# EAGLE design RasPi-Hi_Power (EAGLE 8.4.0)
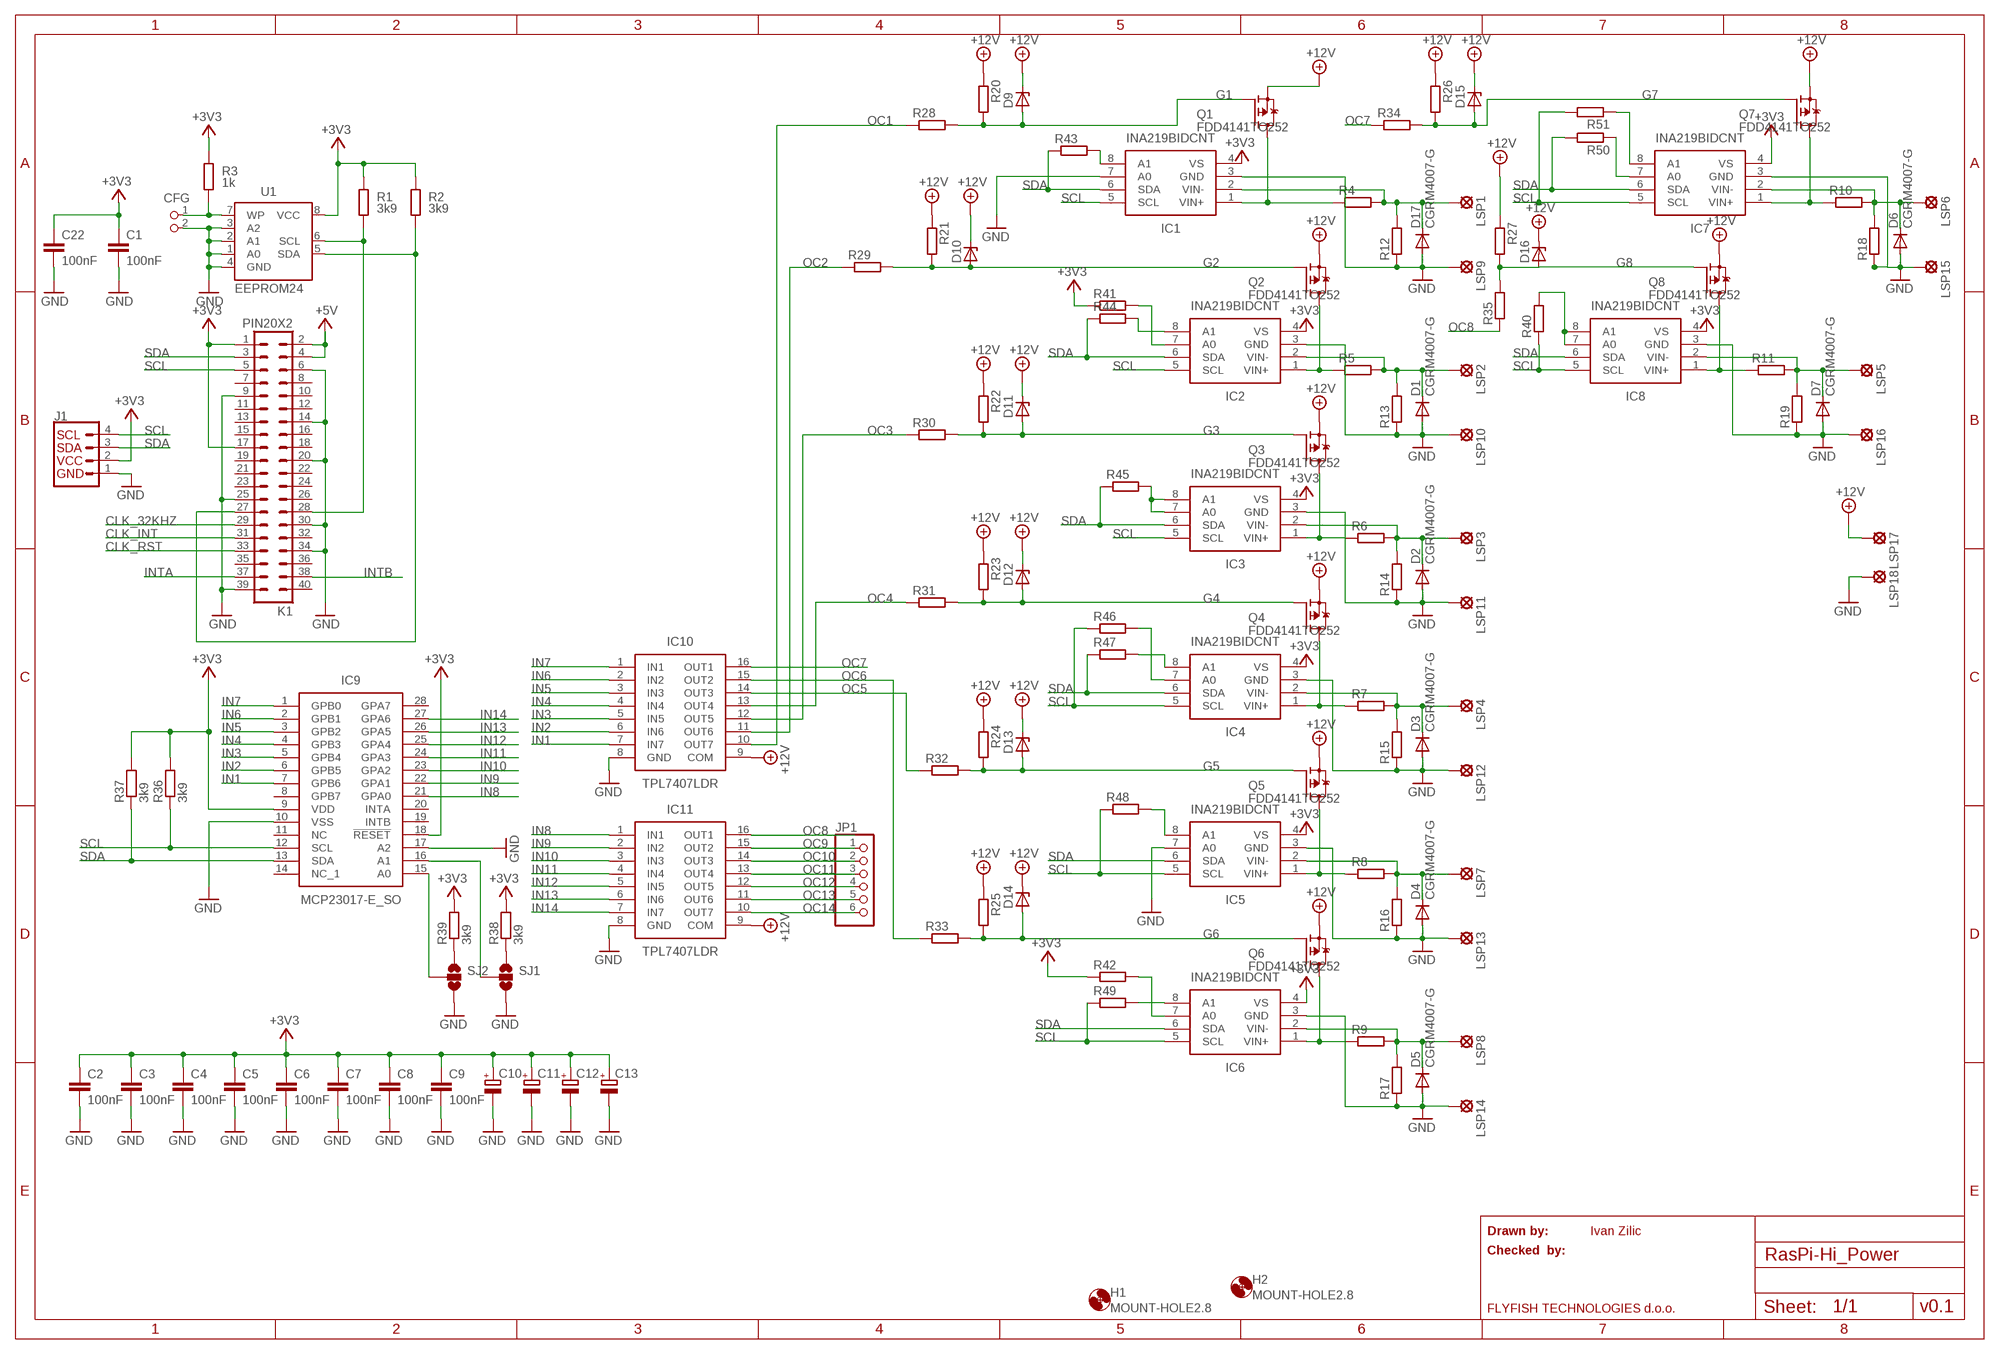
[diagram p0: schematic, sheet 1]

## Parts
C1  100nF  C-EUC0805K  [C0805K]
C2  100nF  C-EUC0805K  [C0805K]
C3  100nF  C-EUC0805K  [C0805K]
C4  100nF  C-EUC0805K  [C0805K]
C5  100nF  C-EUC0805K  [C0805K]
C6  100nF  C-EUC0805K  [C0805K]
C7  100nF  C-EUC0805K  [C0805K]
C8  100nF  C-EUC0805K  [C0805K]
C9  100nF  C-EUC0805K  [C0805K]
C10  CPOL-EUSMCD  [SMC_D]
C11  CPOL-EUSMCD  [SMC_D]
C12  CPOL-EUSMCD  [SMC_D]
C13  CPOL-EUSMCD  [SMC_D]
C22  100nF  C-EUC0805K  [C0805K]
CFG  PIN2_100  [PIN_W_2]
D1  CGRM4007-G  [SOD-123_MINI-SMA]
D2  CGRM4007-G  [SOD-123_MINI-SMA]
D3  CGRM4007-G  [SOD-123_MINI-SMA]
D4  CGRM4007-G  [SOD-123_MINI-SMA]
D5  CGRM4007-G  [SOD-123_MINI-SMA]
D6  CGRM4007-G  [SOD-123_MINI-SMA]
D7  CGRM4007-G  [SOD-123_MINI-SMA]
D9  ZENER-DIODESOT23  [SOT23]
D10  ZENER-DIODESOT23  [SOT23]
D11  ZENER-DIODESOT23  [SOT23]
D12  ZENER-DIODESOT23  [SOT23]
D13  ZENER-DIODESOT23  [SOT23]
D14  ZENER-DIODESOT23  [SOT23]
D15  ZENER-DIODESOT23  [SOT23]
D16  ZENER-DIODESOT23  [SOT23]
D17  CGRM4007-G  [SOD-123_MINI-SMA]
H1  MOUNT-HOLE2.8  [2,8]
H2  MOUNT-HOLE2.8  [2,8]
IC1  INA219BIDCNT  [SOT65P280X145-8N]
IC2  INA219BIDCNT  [SOT65P280X145-8N]
IC3  INA219BIDCNT  [SOT65P280X145-8N]
IC4  INA219BIDCNT  [SOT65P280X145-8N]
IC5  INA219BIDCNT  [SOT65P280X145-8N]
IC6  INA219BIDCNT  [SOT65P280X145-8N]
IC7  INA219BIDCNT  [SOT65P280X145-8N]
IC8  INA219BIDCNT  [SOT65P280X145-8N]
IC9  MCP23017-E_SO  [SOIC127P1030X265-28N]
IC10  TPL7407LDR  [SOIC127P600X175-16N]
IC11  TPL7407LDR  [SOIC127P600X175-16N]
J1  I2C_STANDARD  [1X04]
JP1  PINHD-1X6  [1X06]
K1  PIN20X2  [PIN_20X2]
LSP1  SE13  [SE13]
LSP2  SE13  [SE13]
LSP3  SE13  [SE13]
LSP4  SE13  [SE13]
LSP5  SE13  [SE13]
LSP6  SE13  [SE13]
LSP7  SE13  [SE13]
LSP8  SE13  [SE13]
LSP9  SE13  [SE13]
LSP10  SE13  [SE13]
LSP11  SE13  [SE13]
LSP12  SE13  [SE13]
LSP13  SE13  [SE13]
LSP14  SE13  [SE13]
LSP15  SE13  [SE13]
LSP16  SE13  [SE13]
LSP17  SE13  [SE13]
LSP18  SE13  [SE13]
Q1  FDD4141TO252  [TO252]
Q2  FDD4141TO252  [TO252]
Q3  FDD4141TO252  [TO252]
Q4  FDD4141TO252  [TO252]
Q5  FDD4141TO252  [TO252]
Q6  FDD4141TO252  [TO252]
Q7  FDD4141TO252  [TO252]
Q8  FDD4141TO252  [TO252]
R1  3k9  R-EU_M0805  [M0805]
R2  3k9  R-EU_M0805  [M0805]
R3  1k  R-EU_M0805  [M0805]
R4  R-EU_R1210  [R1210]
R5  R-EU_R1210  [R1210]
R6  R-EU_R1210  [R1210]
R7  R-EU_R1210  [R1210]
R8  R-EU_R1210  [R1210]
R9  R-EU_R1210  [R1210]
R10  R-EU_R1210  [R1210]
R11  R-EU_R1210  [R1210]
R12  R-EU_R0805  [R0805]
R13  R-EU_R0805  [R0805]
R14  R-EU_R0805  [R0805]
R15  R-EU_R0805  [R0805]
R16  R-EU_R0805  [R0805]
R17  R-EU_R0805  [R0805]
R18  R-EU_R0805  [R0805]
R19  R-EU_R0805  [R0805]
R20  R-EU_R0805  [R0805]
R21  R-EU_R0805  [R0805]
R22  R-EU_R0805  [R0805]
R23  R-EU_R0805  [R0805]
R24  R-EU_R0805  [R0805]
R25  R-EU_R0805  [R0805]
R26  R-EU_R0805  [R0805]
R27  R-EU_R0805  [R0805]
R28  R-EU_R0805  [R0805]
R29  R-EU_R0805  [R0805]
R30  R-EU_R0805  [R0805]
R31  R-EU_R0805  [R0805]
R32  R-EU_R0805  [R0805]
R33  R-EU_R0805  [R0805]
R34  R-EU_R0805  [R0805]
R35  R-EU_R0805  [R0805]
R36  3k9  R-EU_M0805  [M0805]
R37  3k9  R-EU_M0805  [M0805]
R38  3k9  R-EU_R0603  [R0603]
R39  3k9  R-EU_R0603  [R0603]
R40  R-EU_R0603  [R0603]
R41  R-EU_R0805  [R0805]
R42  R-EU_R0805  [R0805]
R43  R-EU_R0805  [R0805]
R44  R-EU_R0805  [R0805]
R45  R-EU_R0805  [R0805]
R46  R-EU_R0805  [R0805]
R47  R-EU_R0805  [R0805]
R48  R-EU_R0805  [R0805]
R49  R-EU_R0805  [R0805]
R50  R-EU_R0805  [R0805]
R51  R-EU_R0805  [R0805]
SJ1  SOLDERJUMPER_2WAYT  [SJ_2]
SJ2  SOLDERJUMPER_2WAYT  [SJ_2]
U1  EEPROM24  [SOIC8]

## Nets
+3V3: C1.1 C2.1 C3.1 C4.1 C5.1 C6.1 C7.1 C8.1 C9.1 C10.+ C11.+ C12.+ C13.+ C22.1 IC1.4(VS) IC2.4(VS) IC3.4(VS) IC4.4(VS) IC5.4(VS) IC6.4(VS) IC7.4(VS) IC8.4(VS) IC9.9(VDD) IC9.18(!RESET) J1.2 K1.1 K1.17 R1.2 R2.2 R3.2 R36.2 R37.2 R38.2 R39.2 R41.1 R42.1 U1.8(VCC)
+5V: K1.2 K1.4
+12V: D9.3(C) D10.3(C) D11.3(C) D12.3(C) D13.3(C) D14.3(C) D15.3(C) D16.3(C) IC10.9(COM) IC11.9(COM) LSP17.MP Q1.2(S) Q2.2(S) Q3.2(S) Q4.2(S) Q5.2(S) Q6.2(S) Q7.2(S) Q8.2(S) R20.1 R21.1 R22.1 R23.1 R24.1 R25.1 R26.1 R27.1
CLK_32KHZ: K1.29
CLK_INT: K1.31
CLK_RST: K1.33
G1: D9.1(A) Q1.1(G) R20.2 R28.2
G2: D10.1(A) Q2.1(G) R21.2 R29.2
G3: D11.1(A) Q3.1(G) R22.2 R30.2
G4: D12.1(A) Q4.1(G) R23.2 R31.2
G5: D13.1(A) Q5.1(G) R24.2 R32.2
G6: D14.1(A) Q6.1(G) R25.2 R33.2
G7: D15.1(A) Q7.1(G) R26.2 R34.2
G8: D16.1(A) Q8.1(G) R27.2 R35.2
GND: C1.2 C2.2 C3.2 C4.2 C5.2 C6.2 C7.2 C8.2 C9.2 C10.- C11.- C12.- C13.- C22.2 CFG.2 D1.A D2.A D3.A D4.A D5.A D6.A D7.A D17.A IC1.3(GND) IC1.7(A0) IC2.3(GND) IC3.3(GND) IC4.3(GND) IC5.3(GND) IC5.7(A0) IC6.3(GND) IC7.3(GND) IC8.3(GND) IC9.10(VSS) IC9.17(A2) IC10.8(GND) IC11.8(GND) J1.1 K1.6 K1.9 K1.14 K1.20 K1.25 K1.30 K1.34 K1.39 LSP9.MP LSP10.MP LSP11.MP LSP12.MP LSP13.MP LSP14.MP LSP15.MP LSP16.MP LSP18.MP R12.1 R13.1 R14.1 R15.1 R16.1 R17.1 R18.1 R19.1 SJ1.3 SJ2.3 U1.1(A0) U1.2(A1) U1.3(A2) U1.4(GND)
IN1: IC9.7(GPB6) IC10.7(IN7)
IN2: IC9.6(GPB5) IC10.6(IN6)
IN3: IC9.5(GPB4) IC10.5(IN5)
IN4: IC9.4(GPB3) IC10.4(IN4)
IN5: IC9.3(GPB2) IC10.3(IN3)
IN6: IC9.2(GPB1) IC10.2(IN2)
IN7: IC9.1(GPB0) IC10.1(IN1)
IN8: IC9.21(GPA0) IC11.1(IN1)
IN9: IC9.22(GPA1) IC11.2(IN2)
IN10: IC9.23(GPA2) IC11.3(IN3)
IN11: IC9.24(GPA3) IC11.4(IN4)
IN12: IC9.25(GPA4) IC11.5(IN5)
IN13: IC9.26(GPA5) IC11.6(IN6)
IN14: IC9.27(GPA6) IC11.7(IN7)
INTA: K1.37
INTB: K1.38
N$1: IC8.1(VIN+) Q8.3(D) R11.1
N$2: IC9.15(A0) SJ2.2
N$3: CFG.1 R3.1 U1.7(WP)
N$4: IC7.1(VIN+) Q7.3(D) R10.1
N$5: D6.C IC7.2(VIN-) LSP6.MP R10.2 R18.2
N$6: IC3.1(VIN+) Q3.3(D) R6.1
N$7: IC4.1(VIN+) Q4.3(D) R7.1
N$8: D3.C IC4.2(VIN-) LSP4.MP R7.2 R15.2
N$9: D2.C IC3.2(VIN-) LSP3.MP R6.2 R14.2
N$10: IC2.1(VIN+) Q2.3(D) R5.1
N$11: D1.C IC2.2(VIN-) LSP2.MP R5.2 R13.2
N$12: IC5.1(VIN+) Q5.3(D) R8.1
N$13: D4.C IC5.2(VIN-) LSP7.MP R8.2 R16.2
N$14: IC6.1(VIN+) Q6.3(D) R9.1
N$16: D5.C IC6.2(VIN-) LSP8.MP R9.2 R17.2
N$17: K1.28 R1.1 U1.6(SCL)
N$18: IC1.1(VIN+) Q1.3(D) R4.1
N$19: D17.C IC1.2(VIN-) LSP1.MP R4.2 R12.2
N$20: IC9.16(A1) SJ1.2
N$21: R38.1 SJ1.1
N$22: R39.1 SJ2.1
N$23: K1.27 R2.1 U1.5(SDA)
N$24: IC8.7(A0) IC8.8(A1) R40.2
N$25: IC2.7(A0) R41.2
N$26: IC6.7(A0) R42.2
N$27: IC1.8(A1) R43.2
N$28: IC2.8(A1) R44.2
N$29: IC3.7(A0) IC3.8(A1) R45.2
N$30: IC4.8(A1) R47.2
N$31: IC4.7(A0) R46.2
N$32: IC5.8(A1) R48.2
N$33: IC6.8(A1) R49.2
N$35: IC7.8(A1) R51.1
N$36: IC7.7(A0) R50.1
OC1: IC10.10(OUT7) R28.1
OC2: IC10.11(OUT6) R29.1
OC3: IC10.12(OUT5) R30.1
OC4: IC10.13(OUT4) R31.1
OC5: IC10.14(OUT3) R32.1
OC6: IC10.15(OUT2) R33.1
OC7: IC10.16(OUT1) R34.1
OC8: IC11.16(OUT1) R35.1
OC9: IC11.15(OUT2) JP1.1
OC10: IC11.14(OUT3) JP1.2
OC11: IC11.13(OUT4) JP1.3
OC12: IC11.12(OUT5) JP1.4
OC13: IC11.11(OUT6) JP1.5
OC14: IC11.10(OUT7) JP1.6
OUT8: D7.C IC8.2(VIN-) LSP5.MP R11.2 R19.2
SCL: IC1.5(SCL) IC2.5(SCL) IC3.5(SCL) IC4.5(SCL) IC5.5(SCL) IC6.5(SCL) IC7.5(SCL) IC8.5(SCL) IC9.12(SCL) J1.4 K1.5 R36.1 R40.1 R46.1 R48.1 R49.1 R51.2
SDA: IC1.6(SDA) IC2.6(SDA) IC3.6(SDA) IC4.6(SDA) IC5.6(SDA) IC6.6(SDA) IC7.6(SDA) IC8.6(SDA) IC9.13(SDA) J1.3 K1.3 R37.1 R43.1 R44.1 R45.1 R47.1 R50.2
Unconnected: IC9.8(GPB7) IC9.11(NC) IC9.14(NC_1) IC9.19(INTB) IC9.20(INTA) IC9.28(GPA7) K1.7 K1.8 K1.10 K1.11 K1.12 K1.13 K1.15 K1.16 K1.18 K1.19 K1.21 K1.22 K1.23 K1.24 K1.26 K1.32 K1.35 K1.36 K1.40

## Notes on the sheet
- Drawn by: | Ivan Zilic
- Checked  by:
- FLYFISH TECHNOLOGIES d.o.o. | v0.1

## Library data of the parts
C1-C9 C22 = resistor:C-EU: CAPACITOR, European symbol; DIELECTRIC: X7R
C10-C13 = rcl:CPOL-EU: POLARIZED CAPACITOR, European symbol
CFG = FLYFISH:PIN2
D1-D7 D17 = diode:CGRM400*-G: Molded plasitc,JEDEC SOD-123/Mini SMA Source: Comchip CGRM4001-G.pdf
D9-D16 = diode:ZENER-DIODE: Z-Diode
H1 H2 = holes:MOUNT-HOLE: MOUNTING HOLE with drill center marker
IC1-IC8 = SamacSys_Parts:INA219BIDCNT: INA219BIDCNT, Intelligent Power Switch High Side Current Shunt, Power Monitor, 0.01A, 5.5V, 8-Pin, SOT-23 <https://componentsearchengine.com/Images/3/INA219BIDCNT.jpg> Source: Datasheet <http://www.ti.com/lit/ds/symlink/ina219.pdf>; DESCRIPTION: INA219BIDCNT, Intelligent Power Switch High Side Current Shunt, Power Monitor, 0.01A, 5.5V, 8-Pin, SOT-23; HEIGHT: 1.45mm; MANUFACTURER_NAME: Texas Instruments; MANUFACTURER_PART_NUMBER: INA219BIDCNT; RS_PART_NUMBER: 7300556P; SUPPLIER_NAME: RS
IC9 = SamacSys_Parts:MCP23017-E_SO: 16-bit I/O Expander,I2C,MCP23017-E/SO <https://componentsearchengine.com/Images/3/MCP23017-E_SO.gif> Source: Datasheet <http://docs-europe.electrocomponents.com/webdocs/0a78/0900766b80a784c3.pdf>; ALLIED_NUMBER: 70046137; DESCRIPTION: 16-bit I/O Expander,I2C,MCP23017-E/SO; HEIGHT: 2.65mm; MANUFACTURER_NAME: Microchip; MANUFACTURER_PART_NUMBER: MCP23017-E/SO; RS_PART_NUMBER: 0403816P; SUPPLIER_NAME: RS
IC10 IC11 = SamacSys_Parts:TPL7407LDR: 40V, 7-Channel NMOS Array, Low Side Driver <https://componentsearchengine.com/Images/1/TPL7407LDR.jpg> Source: Datasheet <http://www.ti.com/lit/gpn/tpl7407l>; DESCRIPTION: 40V, 7-Channel NMOS Array, Low Side Driver; HEIGHT: 1.75mm; MANUFACTURER_NAME: Texas Instruments; MANUFACTURER_PART_NUMBER: TPL7407LDR; SUPPLIER_NAME: RS
J1 = SparkFun-Connectors:I2C_STANDARD: SparkFun I2C Standard Pinout Header SparkFun has standardized on a pinout for all I2C based sensor breakouts. This pinout allows I2C boards to be plugged directly into the headers on Arduino Uno compatible boards, and to be daisy chained easily. Example SparkFun Products: SparkFun Atmospheric Sensor Breakout - BME280 <https://www.sparkfun.com/products/13676> SparkFun Altitude/Pressure Sensor Breakout - MPL3115A2 <https://www.sparkfun.com/products/11084> SparkFun TOF Range Finder Sensor - VL6180 <https://www.sparkfun.com/products/12785>
JP1 = pinhead:PINHD-1X6: PIN HEADER
K1 = FLYFISH:PIN20X2
LSP1-LSP18 = solpad:SE13: SOLDER PAD E1542, drill 1,3mm, distributor Buerklin, 07F815
Q1-Q8 = transistor-fet:FDD4141: P-Channel PowerTrench® MOSFET Source: FDD4141.pdf
R1-R3 R36-R39 = resistor:R-EU_: RESISTOR, European symbol; TOLERANCE: 5%
R4-R35 R40-R51 = rcl:R-EU_: RESISTOR, European symbol
SJ1 SJ2 = SparkFun-Retired:SOLDERJUMPER_2WAY: Solder Jumper 2 way solder jumper
U1 = FLYFISH:EEPROM24

## Board
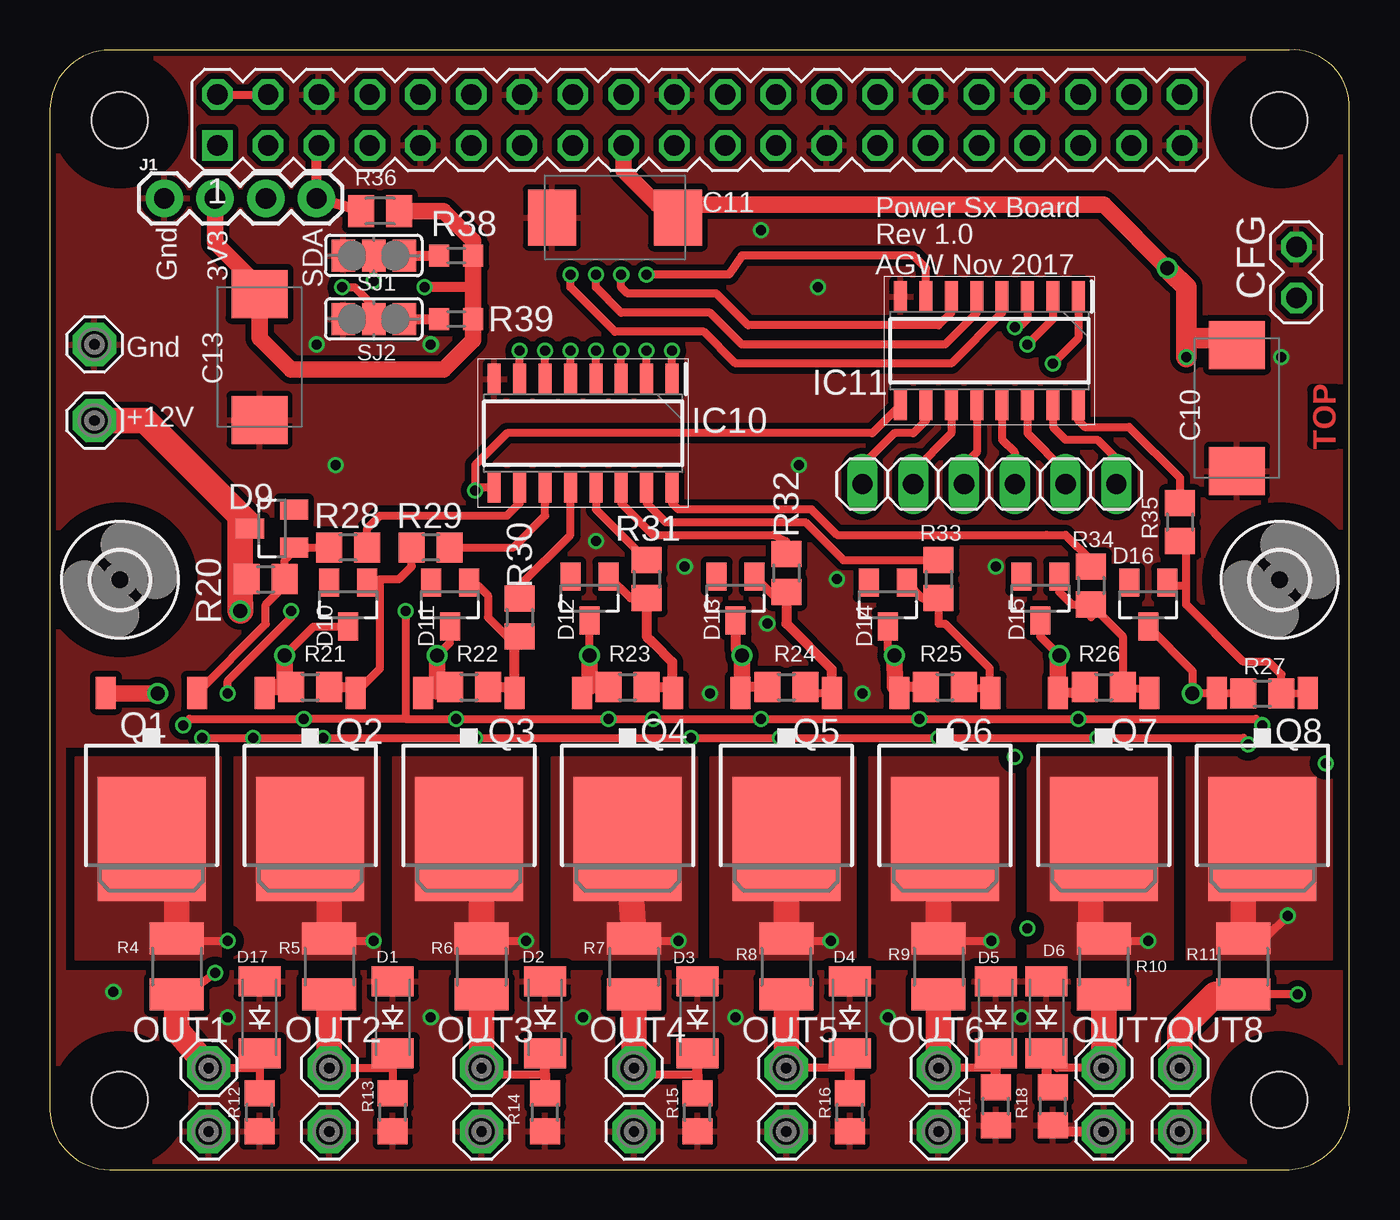
[diagram p1: board, top side]
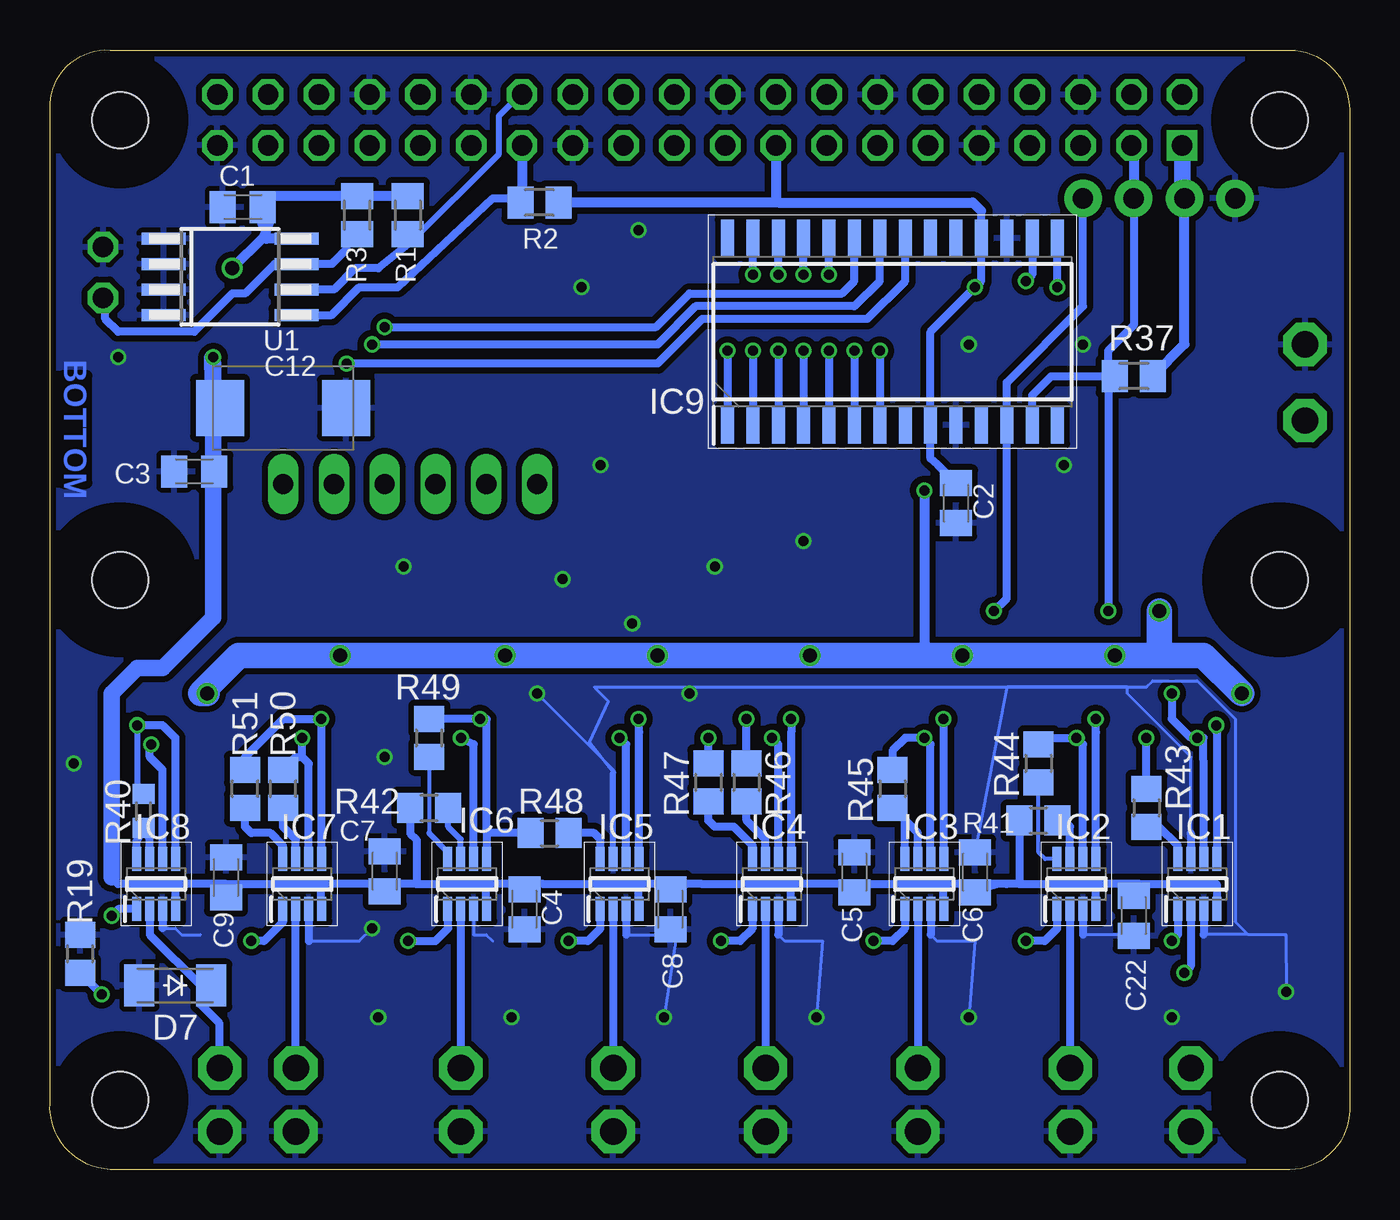
[diagram p2: board, bottom side, seen from below]

Size 65 x 56 mm. Coordinates in mm from the lower left corner, seen from the top.
Outline: 0,3 arc90 3,0 62,0 arc90 65,3.32 65,53.32 arc90 62,56 3,56 arc90 0,53 0,3
Copper layers (1*16): Top 0.035mm / dielectric 1.5mm / Bottom 0.035mm
Design rules "ITEADstudio_DRC": minimum track width 6mil, minimum drill 12mil, track to track 6mil, track to pad 6mil, pad to pad 6mil, via to via 6mil, smd to smd 0mil, copper to edge 10mil, drill to drill 10mil, minimum pad ring 10mil, minimum via ring 6mil, stop-mask expansion 2mil, vias tented up to drill 100mil, thermal gap 10mil
Holes 2.8 mm at 3.5,3.5 3.5,52.5 61.5,52.5 61.5,3.5
tRestrict: area 1.9,51 to 5,54; area 60,51 to 63,54; area 60,1.9 to 63,5; area 1.9,1.9 to 5,5
bRestrict: area 1.9,1.9 to 5,5; area 1.9,51 to 5,54; area 60,1.9 to 63,5; area 60,51 to 63,54

### Footprints (pad centres in the part's own frame; a part is rotated, then mirrored left to right if it is on the bottom)
C0805K = smd 1.3 x 1.6: 1 -1,0; 2 1,0
SMC_D = smd 2.4 x 2.8: + -3.15,0; - 3.15,0
PIN_W_2 = drill 1.016 octagon: 1 0,0; 2 0,-2.54
SOD-123_MINI-SMA = smd 1.5 x 2.1: A 1.8,0; C -1.8,0
SOT23 = smd 1 x 1.4: 1 -0.95,-1.1; 2 0.95,-1.1; 3 0,1.1
2,8 = hole 2.8: 0,0
SOT65P280X145-8N = smd 1.2 x 0.45: 1 -1.25,0.975; 2 -1.25,0.325; 3 -1.25,-0.325; 4 -1.25,-0.975; 5 1.25,-0.975; 6 1.25,-0.325; 7 1.25,0.325; 8 1.25,0.975
SOIC127P1030X265-28N = smd 1.85 x 0.65: 1 -4.675,8.255; 2 -4.675,6.985; 3 -4.675,5.715; 4 -4.675,4.445; 5 -4.675,3.175; 6 -4.675,1.905; 7 -4.675,0.635; 8 -4.675,-0.635; 9 -4.675,-1.905; 10 -4.675,-3.175; 11 -4.675,-4.445; 12 -4.675,-5.715; 13 -4.675,-6.985; 14 -4.675,-8.255; 15 4.675,-8.255; 16 4.675,-6.985; 17 4.675,-5.715; 18 4.675,-4.445; 19 4.675,-3.175; 20 4.675,-1.905; 21 4.675,-0.635; 22 4.675,0.635; 23 4.675,1.905; 24 4.675,3.175; 25 4.675,4.445; 26 4.675,5.715; 27 4.675,6.985; 28 4.675,8.255
SOIC127P600X175-16N = smd 1.525 x 0.65: 1 -2.712,4.445; 2 -2.712,3.175; 3 -2.712,1.905; 4 -2.712,0.635; 5 -2.712,-0.635; 6 -2.712,-1.905; 7 -2.712,-3.175; 8 -2.712,-4.445; 9 2.712,-4.445; 10 2.712,-3.175; 11 2.712,-1.905; 12 2.712,-0.635; 13 2.712,0.635; 14 2.712,1.905; 15 2.712,3.175; 16 2.712,4.445
1X04 = drill 1.016 pad 1.88: 1 0,0; 2 2.54,0; 3 5.08,0; 4 7.62,0
1X06 = drill 1.016 long: 1 -6.35,0; 2 -3.81,0; 3 -1.27,0; 4 1.27,0; 5 3.81,0; 6 6.35,0
PIN_20X2 = drill 1.016 square: 1 -24.13,-1.27 | drill 1.016 octagon: 2 -24.13,1.27; 3 -21.59,-1.27; 4 -21.59,1.27; 5 -19.05,-1.27; 6 -19.05,1.27; 7 -16.51,-1.27; 8 -16.51,1.27; 9 -13.97,-1.27; 10 -13.97,1.27; 11 -11.43,-1.27; 12 -11.43,1.27; 13 -8.89,-1.27; 14 -8.89,1.27; 15 -6.35,-1.27; 16 -6.35,1.27; 17 -3.81,-1.27; 18 -3.81,1.27; 19 -1.27,-1.27; 20 -1.27,1.27; 21 1.27,-1.27; 22 1.27,1.27; 23 3.81,-1.27; 24 3.81,1.27; 25 6.35,-1.27; 26 6.35,1.27; 27 8.89,-1.27; 28 8.89,1.27; 29 11.43,-1.27; 30 11.43,1.27; 31 13.97,-1.27; 32 13.97,1.27; 33 16.51,-1.27; 34 16.51,1.27; 35 19.05,-1.27; 36 19.05,1.27; 37 21.59,-1.27; 38 21.59,1.27; 39 24.13,-1.27; 40 24.13,1.27
SE13 = drill 1.321 pad 2.159 octagon: MP 0,0
TO252 = smd 1 x 1.6: 1 -2.28,-4.8; 2 2.28,-4.8 | smd 5.4 x 6.2: 3 0,2.5
M0805 = smd 1.3 x 1.6: 1 -0.95,0; 2 0.95,0
R1210 = smd 1.6 x 2.7: 1 -1.4,0; 2 1.4,0
R0805 = smd 1.3 x 1.5: 1 -0.95,0; 2 0.95,0
R0603 = smd 1 x 1.1: 1 -0.85,0; 2 0.85,0
SJ_2 = smd 1.168 x 1.6: 1 -1.524,0; 2 0,0; 3 1.524,0
SOIC8 = smd 0.6 x 2.2: 1 -1.905,-3.33; 2 -0.635,-3.33; 3 0.635,-3.33; 4 1.905,-3.33; 5 1.905,3.33; 6 0.635,3.33; 7 -0.635,3.33; 8 -1.905,3.33

### Placement (x,y rotation side)
C1  55.36,48.15 180 bottom
C2  19.68,33.34 270 bottom
C3  57.78,34.92 180 bottom
C4  41.27,13.02 270 bottom
C5  24.77,14.88 90 bottom
C6  18.73,14.88 90 bottom
C7  48.26,14.92 90 bottom
C8  33.97,13.02 270 bottom
C9  56.2,14.61 90 bottom
C10  59.37,38.1 270 top
C11  28.26,47.62 180 top
C12  53.34,38.1 0 bottom
C13  10.48,40.64 270 top
C22  10.79,12.7 270 bottom
CFG  62.34,43.61 180 top
D1  17.14,7.62 90 top
D2  24.77,7.62 90 top
D3  32.38,7.62 90 top
D4  40.01,7.62 90 top
D5  47.31,7.62 90 top
D6  49.85,7.62 90 top
D7  58.74,9.21 180 bottom
D9  11.11,32.07 90 top
D10  14.92,28.26 180 top
D11  20,28.26 180 top
D12  26.99,28.57 180 top
D13  34.29,28.57 180 top
D14  41.91,28.26 180 top
D15  49.53,28.57 180 top
D16  54.93,28.26 180 top
D17  10.48,7.62 90 top
H1  3.5,29.5 0 top
H2  61.5,29.5 0 top
IC1  7.62,14.29 90 bottom
IC2  13.65,14.29 90 bottom
IC3  21.27,14.29 90 bottom
IC4  28.89,14.29 90 bottom
IC5  36.51,14.29 90 bottom
IC6  44.13,14.29 90 bottom
IC7  52.39,14.29 90 bottom
IC8  59.69,14.29 90 bottom
IC9  22.86,41.91 90 bottom
IC10  26.67,36.83 270 top
IC11  46.99,40.96 270 top
J1  5.71,48.58 0 top
JP1  46.99,34.29 180 top
K1  32.5,52.5 0 top
LSP1  7.94,5.08 0 top
LSP2  13.97,5.08 0 top
LSP3  21.59,5.08 0 top
LSP4  29.21,5.08 0 top
LSP5  56.52,5.08 0 top
LSP6  52.7,5.08 0 top
LSP7  36.83,5.08 0 top
LSP8  44.45,5.08 0 top
LSP9  7.94,1.91 0 top
LSP10  13.97,1.91 0 top
LSP11  29.21,1.91 0 top
LSP12  21.59,1.91 0 top
LSP13  44.45,1.91 0 top
LSP14  56.52,1.91 0 top
LSP15  52.7,1.91 0 top
LSP16  36.83,1.91 0 top
LSP17  2.22,37.47 0 top
LSP18  2.22,41.27 0 top
Q1  5.08,19.05 180 top
Q2  13.02,19.05 180 top
Q3  20.95,19.05 180 top
Q4  28.89,19.05 180 top
Q5  36.83,19.05 180 top
Q6  44.77,19.05 180 top
Q7  52.7,19.05 180 top
Q8  60.64,19.05 180 top
R1  47.1,47.74 90 bottom
R2  40.52,48.37 0 bottom
R3  49.64,47.74 90 bottom
R4  6.35,10.16 270 top
R5  13.97,10.16 270 top
R6  21.59,10.16 270 top
R7  29.21,10.16 270 top
R8  36.83,10.16 270 top
R9  44.45,10.16 270 top
R10  52.7,10.16 270 top
R11  59.69,10.16 270 top
R12  10.48,2.86 90 top
R13  17.14,2.86 90 top
R14  24.77,2.86 90 top
R15  32.38,2.86 90 top
R16  40.01,2.86 90 top
R17  47.31,3.17 90 top
R18  50.16,3.17 90 top
R19  63.5,10.79 270 bottom
R20  10.79,29.53 0 top
R21  13.02,24.13 0 top
R22  20.95,24.13 0 top
R23  28.89,24.13 0 top
R24  36.83,24.13 0 top
R25  44.77,24.13 0 top
R26  52.7,24.13 0 top
R27  60.64,23.81 0 top
R28  14.92,31.11 180 top
R29  19.05,31.11 180 top
R30  23.5,27.62 270 top
R31  29.84,29.53 270 top
R32  36.83,29.84 270 top
R33  44.45,29.53 270 top
R34  52.07,29.21 270 top
R35  56.52,32.38 270 top
R36  16.51,47.94 0 top
R37  10.79,39.69 0 bottom
R38  20.32,45.72 0 top
R39  20.32,42.55 0 top
R40  60.33,17.93 270 bottom
R41  15.56,17.46 0 bottom
R42  46.04,18.1 0 bottom
R43  10.16,18.1 270 bottom
R44  15.56,20.32 270 bottom
R45  22.86,19.05 270 bottom
R46  30.16,19.37 270 bottom
R47  32.07,19.37 270 bottom
R48  40.01,16.83 0 bottom
R49  46.04,21.59 270 bottom
R50  53.34,19.05 90 bottom
R51  55.24,19.05 90 bottom
SJ1  16.19,45.72 180 top
SJ2  16.19,42.55 180 top
U1  55.99,44.66 270 bottom

### Tracks (layer width: path | path; a pad name or v marks a point on that pad's centre or on a via)
+3V3  (via drill 0.5, 0.7)
  Top 0.152: C10.+ 59.03,41.59 | C11.+ 31.43,47.33 31.43,48.26 | 10.48,44.13 C13.+
  Top 0.508: 56.04,44.93 v55.88,45.09 | 21.17,44.13 v18.73,44.13
  Top 0.61: 31.43,48.26 30.39,48.26
  Top 0.813: J1.2 8.26,46.35 10.48,44.13 | K1.17 28.69,49.96 30.39,48.26 | 56.04,44.93 52.7,48.26 31.43,48.26 | R36.2 19.68,47.94 21.17,46.46 R38.2 21.17,44.13 R39.2 21.17,41.49 19.68,40.01 12.06,40.01 10.48,41.59 C13.+
  Top 1.016: 56.83,41.59 v56.83,40.64 | 56.83,41.59 56.83,44.13 56.04,44.93 | 59.03,41.59 56.83,41.59
  Bottom 0.152: 54.36,47.88 C1.1 53.82,48.69 | 53.68,46.56 U1.8 | 54.18,46.56 54.29,46.67 | J1.2 8.37,48.38 | 43.37,14.28 43.38,14.29 | 58.74,13.06 IC8.4 | 6.67,14.29 6.64,14.27 | IC2.4 12.7,13.06 | IC3.4 20.32,13.06 | IC4.4 27.94,13.06 | IC5.4 35.56,13.06 | IC6.4 43.18,13.06 | IC7.4 51.44,13.06 | v56.83,40.64 56.52,40.64 56.83,40.32 v56.83,40.64 | C22.1 10.48,14.29 | v56.83,40.64 56.88,40.59 | C3.1 56.84,38.1 C12.+ | C12.+ | C7.1 48.26,14.29 | C9.1 56.2,14.29 | C4.1 40.32,14.29 | C8.1 32.38,14.29 | C5.1 24.77,14.29 | C6.1 17.14,14.29 | 13.98,14.29 13.97,14.29 | 44.46,14.29 44.45,14.29 | 16.51,14.29
  Bottom 0.406: 58.74,14.29 58.74,13.06 | 27.94,14.29 24.77,14.29 20.32,14.29 | 35.56,14.29 32.38,14.29 27.94,14.29 | 43.18,14.29 40.32,14.29 35.56,14.29 | 43.18,14.29 43.38,14.29 44.45,14.29 46.67,14.29 | 20.32,14.29 17.14,14.29 16.51,14.29 13.97,14.29 12.7,14.29 | 12.7,14.29 10.48,14.29 6.67,14.29 | 6.64,14.27 IC1.4 | 12.7,13.06 12.7,14.29 | 20.32,13.06 20.32,14.29 | 27.94,13.06 27.94,14.29 | 35.56,13.06 35.56,14.29 | 43.18,13.06 43.18,14.29 | 51.44,14.29 48.26,14.29 46.67,14.29 | 51.44,14.29 56.2,14.29 58.74,14.29 | 51.44,13.06 51.44,14.29 | 58.74,14.29 61.59,14.29 61.91,14.61 | 18.41,47.94 IC9.18 18.41,44.45 v18.73,44.13 20.95,41.91 IC9.9 20.95,35.56 20.59,35.24 C2.1 | R42.1 46.99,16.82 46.67,16.51 46.67,14.29 | R41.1 16.51,14.29
  Bottom 0.508: R1.2 R3.2 53.82,48.69 | C1.1 54.36,47.24 53.98,47.62 54.29,46.67 v55.88,45.09 | U1.8 54.18,46.56 | 28.57,48.37 R2.2 | 28.57,48.37 18.84,48.37 18.41,47.94 | K1.17 28.69,48.49 28.57,48.37 | R37.2 8.26,41.28 J1.2
  Bottom 0.813: 8.37,48.38 K1.1 | 61.91,14.61 61.91,23.81 60.64,25.08 59.37,25.08 56.83,27.62 56.83,40.32 | 56.84,38.1 56.88,40.59
+5V
  Top 0.406: K1.2 K1.4
+12V  (via drill 0.5, 0.7)
  Top 0.152: 54.93,26.67 D16.3 | 51.79,23.85 R26.1 | 42.23,24.13 42.06,23.96 Q6.2 42.27,24.17 | 34.83,24.13 Q5.2 | 26.99,24.13 26.99,23.91 Q4.2 26.89,23.81 | R23.1 28.25,24.13 | R22.1 20.04,23.85 | 11.02,24.13 Q2.2 | 58.4,23.81 Q8.2 | 19.27,23.81 Q3.2 19.37,23.91 | Q5.2 34.51,23.81 | v21.27,33.97 21.42,34.12 | 11.69,25.66 v11.75,25.72 | 9.53,32.53 D9.3 10.01,32.22 | 50.42,25.66 v50.48,25.72 | Q5.2 34.61,23.91 | 2.84,23.81 Q1.2 | v9.53,27.94 | v42.23,25.72 41.91,26.04
  Top 0.406: 11.02,24.13 R21.1 | IC10.9 21.42,34.12 | IC11.9 41.13,36.83 22.86,36.83 21.27,35.24 v21.27,33.97 | D16.3 57.15,24.93 v57.15,23.81 58.4,23.81 R27.1 | v26.99,25.72 D12.3 | v50.48,25.72 49.53,26.67 D15.3 | 41.91,26.04 D14.3 | v19.37,25.72 20,26.35 D11.3 | v11.75,25.72 13.19,27.16 D10.3
  Top 0.508: 51.79,23.85 Q7.2 | R25.1 42.23,24.13 | R24.1 34.83,24.13 | 28.25,24.13 26.99,24.13 | Q3.2 20.04,23.85 | D13.3 34.29,26.04 v34.61,25.72 | D12.3 27.16,27.14
  Top 0.813: 42.27,24.17 v42.23,25.72 | Q2.2 11.11,24.13 11.75,24.13 11.75,25.6 11.69,25.66 | Q7.2 50.42,25.66 | 34.61,23.91 v34.61,25.72 | 26.99,24.13 v26.99,25.72 | 19.37,23.91 v19.37,25.72 | v5.4,23.81 2.84,23.81
  Top 1.27: LSP17.MP 4.76,37.47 9.53,32.7 | 9.53,32.7 10.01,32.22 | R20.1 9.53,29.21 9.53,28.89 v9.53,27.94 | v9.53,27.94 9.53,32.7
  Bottom 0.152: 10.48,26.04 10.79,25.72
  Bottom 0.508: v21.27,33.97 21.27,25.72
  Bottom 1.27: 9.53,25.72 10.79,25.72 v11.75,25.72 v19.37,25.72 21.27,25.72 v26.99,25.72 v34.61,25.72 v42.23,25.72 v50.48,25.72 55.56,25.72 57.47,23.81 v57.15,23.81 | 9.53,25.72 7.3,25.72 v5.4,23.81 | v9.53,27.94 9.53,25.72
G1
  Top 0.152: 12.38,31.12 D9.1 | R28.2 | R20.2 11.75,29.21
  Top 0.406: R28.2 12.38,31.12 11.74,30.48 R20.2 | 7.34,24.17 Q1.1 10.79,27.29 10.79,28.26 11.75,29.21
G2
  Top 0.152: R29.2 17.78,31.11 | 15.3,23.81 Q2.1 15.3,24.07 15.24,24.13 | 16.51,29.53 16.34,29.36
  Top 0.406: Q2.1 16.51,25.06 16.51,29.53 17.46,29.53 18.1,30.16 R29.2 | 16.34,29.36 D10.1
  Top 0.508: R21.2 15.24,24.13
G3
  Top 0.152: R30.2 22.86,26.67 | R30.2 23.87,26.3 | 23.23,26.41 R30.2 | R22.2 23.23,24.13 Q3.1 22.95,24.13 | D11.1 20.95,29.21 21.42,29.21
  Top 0.406: 21.42,29.21 21.91,28.72 21.91,27.62 22.86,26.67
  Top 0.508: 23.23,24.13 23.23,26.41 | R22.2 22.95,24.13
G4
  Top 0.152: 31.14,24.09 31.11,24.23 | 31.14,24.09 Q4.1 | 30.16,26.35 | 31.09,24.13 31.14,24.09
  Top 0.406: D12.1 29.04,28.58 R31.2
  Top 0.508: 31.11,24.23 31.11,25.4 30.16,26.35 29.84,26.67 R31.2 | R23.2 31.09,24.13
G5
  Top 0.152: 36.83,27.31 36.83,27.3 | R24.2 38.06,23.85 | 36.34,28.57 36.83,28.57
  Top 0.406: 38.06,23.85 Q5.1 | D13.1 36.34,28.57
  Top 0.508: 36.83,27.3 36.83,28.57 R32.2 | 36.83,27.31 39.11,25.02 Q5.1
G6
  Top 0.152: 46.67,24.45 46.73,24.39 46.91,24.08 | 46.91,24.08 Q6.1 | 46.99,24.61 46.91,24.53 46.91,24.08 | R25.2 45.76,24.08
  Top 0.406: R33.2 | R33.2 44.45,27.3 44.77,27.3 46.99,25.08 46.99,24.61 | 45.76,24.08 46.91,24.08 | D14.1 43.64,28.57 R33.2
G7
  Top 0.152: R26.2 53.71,24.07 | D15.1
  Top 0.406: R34.2 52.07,27.62 | Q7.1 54.98,24.07 53.71,24.07 | R34.2 53.66,26.68 R26.2 | D15.1 50.48,28.89 51.12,28.26 R34.2
G8
  Top 0.152: R35.2 56.83,31.12 | D16.1 56.02,29.21 | 61.59,24.13 R27.2 61.28,23.81
  Top 0.406: 56.83,29.21 56.83,31.12 | 56.02,29.21 56.83,29.21 | 61.28,23.81 61.93,23.81 Q8.1 | 61.59,24.13 61.59,24.77 60.96,25.4 59.69,25.4 56.83,28.26 56.83,29.21
GND  (via drill 0.5)
  Top 0.152: LSP15.MP 52.38,2.23 | R18.1 50.48,1.91
  Top 0.508: 50.48,1.91 LSP15.MP
  Bottom 0.152: IC3.3 20.95,11.76 20.95,11.75 | IC4.3 28.57,11.76 28.57,11.75 | 7.3,11.75 7.29,11.76 5.08,11.76 | 13.34,11.75 13.33,11.76 10.48,11.76 10.48,11.75 | IC7.3 52.06,11.76 52.07,11.75 | 20.95,11.74 20.64,11.43 18.73,11.43 v19.05,7.62 | 28.57,11.74 28.26,11.43 26.35,11.43 v26.67,7.62 | 36.19,11.76 36.2,11.75 33.66,11.75 v34.29,7.62 | 52.06,11.44 52.07,11.43 49.53,11.43 v48.9,12.06 | 59.37,12.07 59.37,12.06 58.74,12.06 58.42,11.75 57.47,11.75 | 5.08,11.76 3.18,11.76 v3.17,8.89 | IC6.3 43.81,11.76 43.81,11.75 43.18,11.75 42.86,11.43 | IC5.7 36.84,16.82 36.83,16.83 | 7.95,16.82 7.94,16.83 | IC1.7 7.95,20.63 7.94,20.64 11.11,23.81 11.11,24.13 17.14,24.13 C6.2 | v40.64,23.81 36.84,20.01 36.84,19.86 38.02,21.36 37.07,23.42 37.78,24.13 10.16,24.13 9.84,24.45 7.62,24.45 5.71,22.54 5.71,12.39 5.08,11.76
  Bottom 0.305: IC5.7 36.84,19.86
  Bottom 0.406: IC1.3 7.29,11.76 | IC2.3 13.33,11.76 | IC3.3 20.95,11.74 | IC4.3 28.57,11.74 | IC5.3 36.19,11.76 | IC7.3 52.06,11.44 | IC8.3 59.37,12.07 | 7.95,16.82 IC1.7
  other vias: 61.59,40.64 48.26,20.64 37.47,35.24 47.31,30.16 39.37,29.53 31.75,30.16 33.02,23.81 63.82,20.32 38.42,44.13 35.56,46.99 19.05,41.27 13.34,41.27 48.58,7.62 41.91,7.62 8.89,7.62 14.29,35.24 35.88,27.3 27.3,31.43
  pour Bottom (isolate 0.305): 0,3 arc90 3,0 62,0 arc90 65,3 65,53 arc90 62,56 3,56 arc90 0,53 0,18.5
  pour Top (isolate 0.305): 0.14,21.27 60.73,21.27 arc90 65,24.59 65,53 arc90 62,56 3,56 arc90 0,53
  pour Top (isolate 0.305): -2.22,21.59 0.64,21.59 0.64,9.84 65.41,9.84 65.72,10.48 65.72,-0.32 65.09,-0.95 1.59,-0.95 -2.22,2.86
IN1  (via drill 0.5)
  Top 0.406: IC10.7 v23.5,40.96
  Bottom 0.406: v23.5,40.96 IC9.7
IN2  (via drill 0.5)
  Top 0.406: IC10.6 v24.77,40.96
  Bottom 0.406: v24.77,40.96 IC9.6
IN3  (via drill 0.5)
  Top 0.406: IC10.5 v26.04,40.96
  Bottom 0.406: v26.04,40.96 IC9.5
IN4  (via drill 0.5)
  Top 0.406: IC10.4 v27.3,40.96
  Bottom 0.406: v27.3,40.96 IC9.4
IN5  (via drill 0.5)
  Top 0.406: IC10.3 v28.57,40.96
  Bottom 0.406: v28.57,40.96 IC9.3
IN6  (via drill 0.5)
  Top 0.406: IC10.2 v29.84,40.96
  Bottom 0.406: v29.84,40.96 IC9.2
IN7  (via drill 0.5)
  Top 0.406: IC10.1 v31.11,40.96
  Bottom 0.406: v31.11,40.96 IC9.1
IN8  (via drill 0.5)
  Top 0.406: IC11.1 51.44,41.59 v50.16,40.32
  Bottom 0.406: v50.16,40.32 34.61,40.32 32.38,42.55 24.13,42.55 22.23,44.45 IC9.21
IN9  (via drill 0.5)
  Top 0.406: v48.9,41.27 50.16,42.55 IC11.2
  Bottom 0.406: v48.9,41.27 34.61,41.27 32.7,43.18 24.77,43.18 23.5,44.45 IC9.22
IN10  (via drill 0.5)
  Top 0.152: 48.58,42.23 v48.26,42.15
  Top 0.406: IC11.3 48.9,42.55 48.58,42.23
  Bottom 0.406: v48.26,42.15 34.69,42.15 33.02,43.81 25.4,43.81 24.77,44.45 IC9.23
IN11  (via drill 0.5)
  Top 0.406: IC11.4 47.62,42.86 45.09,40.32 34.29,40.32 32.7,41.91 28.26,41.91 26.04,44.13 v26.04,44.77
  Bottom 0.406: v26.04,44.77 IC9.24
IN12  (via drill 0.5)
  Top 0.406: IC11.5 46.35,42.86 44.77,41.27 34.61,41.27 33.02,42.86 28.57,42.86 27.3,44.13 v27.3,44.77
  Bottom 0.406: v27.3,44.77 IC9.25
IN13  (via drill 0.5)
  Top 0.406: IC11.6 45.09,42.86 44.45,42.23 34.92,42.23 33.34,43.81 28.89,43.81 28.57,44.13 v28.57,44.77
  Bottom 0.406: v28.57,44.77 IC9.26
IN14  (via drill 0.5)
  Top 0.406: IC11.7 43.81,45.09 43.18,45.72 34.61,45.72 33.97,44.77 v29.84,44.77
  Bottom 0.406: v29.84,44.77 IC9.27
N$1  (via drill 0.5)
  Top 0.152: 58.61,11.56 R11.1 60.77,11.56
  Top 0.406: v61.91,12.7 60.77,11.56
  Top 1.27: R11.1 59.69,15.88 59.37,16.19 Q8.3
  Bottom 0.406: IC8.1 61.58,13.04 v61.91,12.7
  pour Top (isolate 0.406, no thermals): 56.83,20.64 64.14,20.64 64.14,10.48 56.83,10.48
N$2  (via drill 0.5)
  Top 0.152: 16.19,43.18 SJ2.2
  Top 0.406: v14.61,44.13 15.24,44.13 16.19,43.18
  Bottom 0.406: v14.61,44.13 IC9.15
N$3
  Bottom 0.152: 50.16,46.27 R3.1 | U1.7 52.87,45.09 | 62.23,43.49 CFG.1
  Bottom 0.406: 50.16,46.27 50.16,46.04 50.91,45.29 U1.7 53.77,45.29 55.24,43.81 55.88,43.81 57.78,41.91 61.59,41.91 62.23,42.55 62.23,43.49
N$4  (via drill 0.5)
  Top 0.152: 52.07,12.2 R10.1 52.84,11.43
  Top 0.406: 52.84,11.43 v54.93,11.43
  Top 1.27: Q7.3 52.07,15.88 52.07,12.2
  Bottom 0.152: IC7.1 53.34,13.02
  Bottom 0.406: 53.34,13.02 53.34,12.38 54.29,11.43 v54.93,11.43
  pour Top (isolate 0.406, no thermals): 48.9,20.64 56.2,20.64 56.2,10.48 48.9,10.48
N$5
  Top 0.152: D6.C 49.85,5.08 50.37,5.08 | 49.85,4.44 R18.2
  Top 0.406: LSP6.MP 50.37,5.08
  Top 0.508: 49.85,5.08 49.85,4.44
  Top 1.27: LSP6.MP R10.2
  Bottom 0.152: IC7.2
  Bottom 0.406: LSP6.MP IC7.2
N$6  (via drill 0.5)
  Top 0.152: R6.1 22.41,11.56 22.54,11.43
  Top 0.406: 22.54,11.43 v23.81,11.43
  Top 1.27: Q3.3 21.27,15.88 21.59,15.56 R6.1
  Bottom 0.406: IC3.1 22.25,12.04 22.86,11.43 v23.81,11.43
  pour Top (isolate 0.406, no thermals): 17.14,20.64 24.45,20.64 24.45,10.48 17.14,10.48
N$7  (via drill 0.5)
  Top 0.152: R7.1 29.34,11.43
  Top 0.406: 29.34,11.43 v31.43,11.43
  Top 1.27: Q4.3 R7.1
  Bottom 0.406: IC4.1 29.87,12.04 30.48,11.43 v31.43,11.43
  pour Top (isolate 0.406, no thermals): 25.08,20.64 32.38,20.64 32.38,10.48 25.08,10.48
N$8
  Top 0.152: 32.27,4.76 32.38,4.76
  Top 0.406: 29.21,4.76 32.27,4.76
  Top 0.508: D3.C 32.38,4.76 R15.2
  Top 1.27: R7.2 LSP4.MP 29.21,4.76
  Bottom 0.152: 29.2,9.85 29.21,9.84
  Bottom 0.406: IC4.2 29.2,9.85 | 29.21,9.84 LSP4.MP
N$9
  Top 0.152: 24.65,4.76 24.77,4.76
  Top 0.406: 21.59,4.76 24.65,4.76
  Top 0.508: D2.C 24.77,4.76 R14.2
  Top 1.27: R6.2 LSP3.MP 21.59,4.76
  Bottom 0.152: LSP3.MP
  Bottom 0.406: IC3.2 LSP3.MP
N$10  (via drill 0.5)
  Top 0.152: R5.1 14.1,11.43
  Top 0.406: 14.1,11.43 v16.19,11.43
  Top 1.27: Q2.3 13.65,15.88 13.97,15.56 R5.1
  Bottom 0.406: IC2.1 14.63,12.04 15.24,11.43 v16.19,11.43
  pour Top (isolate 0.406, no thermals): 9.21,20.64 16.51,20.64 16.51,10.48 9.21,10.48
N$11
  Top 0.152: D1.C 17.14,5.08
  Top 0.406: R13.2 17.14,5.08 LSP2.MP
  Top 1.27: R5.2 LSP2.MP
  Bottom 0.152: LSP2.MP
  Bottom 0.406: IC2.2 LSP2.MP
N$12  (via drill 0.5)
  Top 0.152: 37.4,11.56 36.83,12.7 | 37.4,11.56 37.47,11.43 | R8.1 37.4,11.56
  Top 0.406: 37.47,11.43 v39.05,11.43
  Top 1.27: Q5.3 R8.1
  Bottom 0.406: IC5.1 37.49,12.04 38.1,11.43 v39.05,11.43
  pour Top (isolate 0.406, no thermals): 33.02,20.64 40.32,20.64 40.32,10.48 33.02,10.48
N$13
  Top 0.152: D4.C 39.89,5.71 39.89,5.08
  Top 0.406: 39.89,5.08 LSP7.MP
  Top 0.508: R16.2 D4.C
  Top 1.27: LSP7.MP R8.2
  Bottom 0.152: LSP7.MP
  Bottom 0.406: IC5.2 LSP7.MP
N$14  (via drill 0.5)
  Top 0.152: R9.1 45.27,11.56 45.4,11.43
  Top 0.406: 45.4,11.43 v47.08,11.43
  Top 1.27: Q6.3 44.45,15.88 R9.1
  Bottom 0.152: 45.09,13.02 IC6.1
  Bottom 0.406: v47.08,11.43 45.72,11.43 45.09,12.06 45.09,13.02
  pour Top (isolate 0.406, no thermals): 40.96,20.64 48.26,20.64 48.26,10.48 40.96,10.48
N$16
  Top 0.152: D5.C 47.1,5.62 47.1,5.08
  Top 0.406: 47.1,5.08 LSP8.MP
  Top 0.508: R17.2 D5.C
  Top 1.27: LSP8.MP R9.2
  Bottom 0.152: IC6.2
  Bottom 0.406: LSP8.MP IC6.2
N$17
  Bottom 0.152: R1.1 47.1,46.47 46.99,46.35 | 41.48,53.77 K1.28
  Bottom 0.305: 46.99,46.35 42.55,50.8 42.55,52.7 41.48,53.77
  Bottom 0.406: U1.6 50.8,44.02 49.73,45.09 48.58,45.09 46.99,46.35
N$18  (via drill 0.5)
  Top 0.152: 6.35,15.88 6.67,16.19 6.67,16.23 Q1.3 | R4.1 6.48,11.43
  Top 0.406: 6.48,11.43 v8.89,11.43
  Top 1.27: 6.35,15.88 R4.1
  Bottom 0.406: IC1.1 8.6,11.72 v8.89,11.43
  pour Top (isolate 0.406, no thermals): 8.57,20.64 8.57,10.48 1.27,10.48 1.27,20.64
N$19  (via drill 0.5)
  Top 0.152: D17.C 10.48,5.08 | 6.54,8.57 R4.2
  Top 0.406: R12.2 10.48,5.08 LSP1.MP | v8.26,9.84 6.54,8.57
  Top 1.27: R4.2 6.35,6.99 LSP1.MP
  Bottom 0.152: LSP1.MP
  Bottom 0.406: IC1.2 7.95,10.17 v8.26,9.84
N$20  (via drill 0.5)
  Top 0.406: v16.19,44.45 SJ1.2
  Bottom 0.406: IC9.16 15.88,44.77 v16.19,44.45
N$21
  Top 0.508: SJ1.1 R38.1
N$22
  Top 0.508: SJ2.1 R39.1
N$23
  Bottom 0.152: 41.39,48.46 R2.1 41.68,48.58
  Bottom 0.406: R2.1 41.39,48.23 | U1.5 50.91,42.75 49.53,44.13 47.62,44.13 42.86,48.58 41.68,48.58
  Bottom 0.508: K1.27 41.39,48.46
N$24
  Bottom 0.406: IC8.7 60.02,16.45 R40.2 60.66,16.42 IC8.8
N$25
  Bottom 0.152: 14.92,17.46 R41.2
  Bottom 0.406: IC2.7 13.98,17.15 14.61,17.78 14.92,17.46
N$26
  Bottom 0.152: R42.2
  Bottom 0.305: IC6.7 44.46,16.52 45.09,17.14 R42.2
N$27
  Bottom 0.152: 10.46,16.7 10.46,17.27 10.29,17.45 10.16,17.45 R43.2 9.53,17.15
  Bottom 0.406: IC1.8 8.6,16.21 9.53,17.15
N$28
  Bottom 0.203: IC2.8 15.22,15.54 15.56,15.88 R44.2
N$29
  Bottom 0.152: R45.2 22.54,17.78 22.25,17.49
  Bottom 0.406: IC3.7 21.6,16.84 22.54,17.78 | IC3.8 22.25,17.49
N$30
  Bottom 0.152: 29.87,16.17 29.84,16.19
  Bottom 0.406: IC4.8 29.87,16.17 | 29.84,16.19 30.8,17.14 31.75,17.14 32.07,17.46 R47.2
N$31
  Bottom 0.406: IC4.7 29.22,16.52 30.16,17.46 R46.2
N$32
  Bottom 0.152: IC5.8 37.47,15.56
  Bottom 0.406: 37.47,15.56 37.47,16.51 37.78,16.83 R48.2
N$33
  Bottom 0.152: 45.11,15.9 IC6.8
  Bottom 0.203: R49.2 46.04,16.83
  Bottom 0.305: 46.04,16.83 45.11,15.9
N$35
  Bottom 0.152: IC7.8 53.34,15.56
  Bottom 0.406: 53.34,15.56 53.34,16.19 53.98,16.83 54.93,16.83 55.24,17.14 R51.1
N$36
  Bottom 0.152: 52.71,16.5 52.7,16.51
  Bottom 0.406: IC7.7 52.71,16.5 | 52.7,16.51 53.34,17.14 R50.1
OC1
  Top 0.152: 23.5,33.34 IC10.10
  Top 0.406: R28.1 15.87,32.06 16.51,32.7 22.86,32.7 23.5,33.34
OC2
  Top 0.152: 24.77,33.34 IC10.11
  Top 0.406: R29.1 23.18,31.11 24.77,32.7 24.77,33.34
OC3
  Top 0.406: R30.1 23.5,29.21 26.04,31.75 IC10.12
OC4
  Top 0.406: IC10.13 27.3,33.02 R31.1
OC5
  Top 0.152: 36.83,31.43 R32.1
  Top 0.406: IC10.14 28.57,33.34 30.16,31.75 36.2,31.75 36.83,31.43
OC6
  Top 0.152: R33.1
  Top 0.406: IC10.15 29.84,33.34 30.8,32.38 37.78,32.38 39.69,30.48 R33.1
OC7
  Top 0.152: 52.07,30.48 R34.1
  Top 0.406: IC10.16 31.11,33.34 31.43,33.02 38.1,33.02 39.37,31.75 49.85,31.75 50.8,31.75 52.07,30.48
OC8
  Top 0.152: IC11.16 51.44,37.47
  Top 0.406: R35.1 56.52,34.61 53.98,37.15 51.75,37.15 51.44,37.47
OC9
  Top 0.152: 53.34,35.56 JP1.1
  Top 0.406: IC11.15 50.16,37.15 50.8,36.51 52.39,36.51 53.34,35.56
OC10
  Top 0.152: 50.8,34.92 JP1.2
  Top 0.406: IC11.14 48.9,36.83 50.8,34.92
OC11
  Top 0.406: IC11.13 47.62,36.51 48.26,35.88 JP1.3
OC12
  Top 0.152: 45.72,35.24 JP1.4
  Top 0.406: IC11.12 46.35,35.88 45.72,35.24
OC13
  Top 0.152: 43.18,34.92 JP1.5
  Top 0.406: IC11.11 45.09,36.83 43.18,34.92
OC14
  Top 0.152: 40.64,35.24 JP1.6
  Top 0.406: IC11.10 43.81,37.47 43.18,36.83 42.23,36.83 40.64,35.24
OUT8  (via drill 0.5)
  Top 0.406: v62.41,8.76 R11.2
  Top 1.27: R11.2 58.29,8.76 56.52,6.99 LSP5.MP
  Bottom 0.152: 56.83,5.08 LSP5.MP | 60.01,13.03 IC8.2 | 57.47,9.21 57.57,9.1 D7.C 57.47,8.26
  Bottom 0.406: 60.01,13.03 60.01,11.75 57.47,9.21 | v62.41,8.76 R19.2 | LSP5.MP 56.52,7.3 57.47,8.26
SCL  (via drill 0.5)
  Top 0.152: K1.5 13.34,51.12 | J1.4 13.34,47.94
  Top 0.406: v6.67,22.23 6.99,22.54 v12.7,22.54 17.78,22.54 | 17.78,22.54 v20.32,22.54 v27.94,22.54 v30.16,22.54 v35.56,22.54 v43.5,22.54 v51.44,22.54 60.33,22.54 v60.64,22.23 | v17.78,27.94 17.78,22.54
  Top 0.508: 13.34,51.12 J1.4 R36.1
  Bottom 0.152: 58.74,15.56 IC8.5 | 43.16,22.52 v43.5,22.54 43.18,22.54 | IC7.5 51.44,15.56 | 13.34,51.12 K1.5 | 53.34,22.54 53.36,22.52 | 60.66,22.2 v60.64,22.23 | 60.64,19.1 R40.1 | R51.2 55.24,20.64
  Bottom 0.305: v60.64,22.23 60.64,19.1
  Bottom 0.406: IC1.5 6.64,21.89 v6.67,22.23 | v60.64,22.23 59.37,22.23 58.74,21.59 58.74,15.56 | IC2.5 12.68,21.89 v12.7,22.54 | IC3.5 20.3,21.89 v20.32,22.54 | IC4.5 27.92,21.89 v27.94,22.54 | IC5.5 35.54,21.89 v35.56,22.54 | 43.16,16.83 IC6.5 | 43.16,16.83 43.16,22.52 | 51.44,15.56 v51.44,22.54 53.34,22.54 55.24,20.64 | J1.4 13.34,43.18 17.14,39.37 IC9.12 17.14,28.57 v17.78,27.94 | R46.1 v30.16,22.54 | R48.1 43.16,16.83 | 43.18,22.54 R49.1
SDA  (via drill 0.5)
  Top 0.406: v7.62,21.59 v10.16,21.59 v13.65,21.59 v21.27,21.59 v28.89,21.59 v32.07,21.59 v36.51,21.59 v44.45,21.59 v52.39,21.59 59.69,21.59 59.93,21.35 v59.93,21.27 | v8.89,23.81 8.89,24.45 12.06,27.62 v12.06,27.94
  Bottom 0.152: IC2.6 | v13.65,21.59 13.34,21.27 | IC3.6 | 20.95,21.27 v21.27,21.59 | 7.94,21.59 v7.62,21.59 | K1.3 10.79,51.12 | 60.01,21.19 v59.93,21.27 | R37.1 12.06,39.69 | R44.1 15.24,21.59
  Bottom 0.406: IC1.6 7.29,19.36 7.3,21.59 v7.62,21.59 | IC2.6 13.34,21.27 | IC3.6 20.95,21.27 | IC4.6 28.57,21.27 v28.89,21.59 | IC5.6 36.19,21.27 v36.51,21.59 | IC6.6 43.81,21.27 v44.45,21.59 | IC7.6 52.06,20.31 52.39,20.64 | 52.39,20.64 v52.39,21.59 | 12.06,39.69 v12.06,27.94 | 12.06,39.69 12.06,40.96 10.79,42.23 J1.3 | v8.89,23.81 8.89,22.54 7.94,21.59 | IC9.13 15.88,38.73 14.92,39.69 12.06,39.69 | IC8.6 59.37,20 60.01,20.64 60.01,21.19 | R43.1 v10.16,21.59 | 15.24,21.59 v13.65,21.59 | v21.27,21.59 22.23,21.59 22.86,20.95 R45.1 | R47.1 v32.07,21.59 | R50.2 52.7,20.64 52.39,20.64
  Bottom 0.508: 10.79,51.12 J1.3

### Text on the board
Top: TOP
Bottom: BOTTOM
tNames: Power Sx Board | Rev 1.0 / AGW Nov 2017 | Gnd | 3V3 | SDA | Gnd | +12V | OUT1 | OUT2 | OUT3 | OUT4 | OUT5 | OUT6 | OUT7 | OUT8